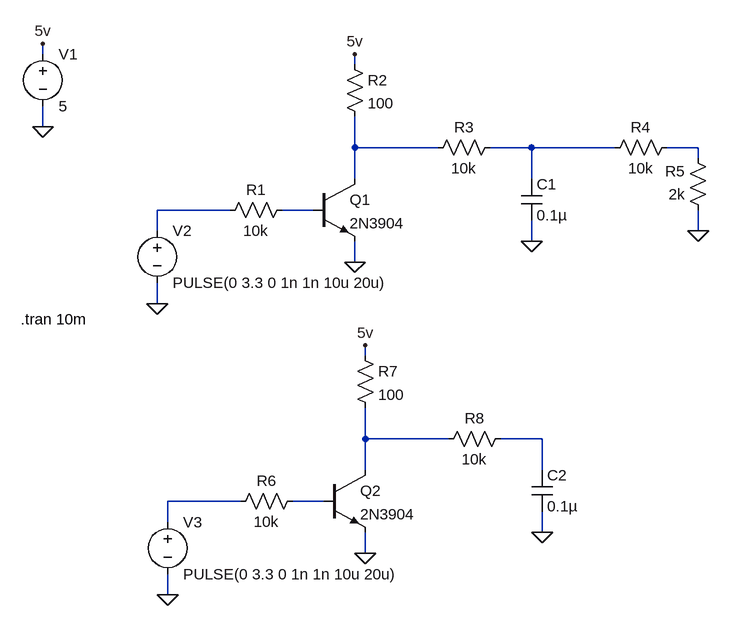
[diagram p0: schematic cmd_pwm_tran.asc]
cmd_pwm_tran.asc, the LTspice schematic file:
Version 4
SHEET 1 880 788
WIRE -304 -64 -304 -80
WIRE 176 -48 176 -64
WIRE -304 48 -304 16
WIRE 176 80 176 32
WIRE 304 80 176 80
WIRE 448 80 384 80
WIRE 576 80 448 80
WIRE 704 80 656 80
WIRE 704 96 704 80
WIRE 176 128 176 80
WIRE 448 128 448 80
WIRE -16 176 -128 176
WIRE 112 176 64 176
WIRE -128 208 -128 176
WIRE 704 208 704 176
WIRE 448 224 448 192
WIRE 176 256 176 224
WIRE -128 320 -128 288
WIRE 192 400 192 384
WIRE 192 528 192 480
WIRE 320 528 192 528
WIRE 464 528 400 528
WIRE 192 576 192 528
WIRE 464 576 464 528
WIRE 0 624 -112 624
WIRE 128 624 80 624
WIRE -112 656 -112 624
WIRE 464 672 464 640
WIRE 192 704 192 672
WIRE -112 768 -112 736
FLAG 176 256 0
FLAG 448 224 0
FLAG 176 -64 5v
FLAG -304 48 0
FLAG -304 -80 5v
FLAG -128 320 0
FLAG 704 208 0
FLAG 192 704 0
FLAG 464 672 0
FLAG 192 384 5v
FLAG -112 768 0
SYMBOL npn 112 128 R0
SYMATTR InstName Q1
SYMATTR Value 2N3904
SYMBOL res 80 160 R90
WINDOW 0 0 56 VBottom 2
WINDOW 3 32 56 VTop 2
SYMATTR InstName R1
SYMATTR Value 10k
SYMBOL res 160 -64 R0
SYMATTR InstName R2
SYMATTR Value 100
SYMBOL res 400 64 R90
WINDOW 0 0 56 VBottom 2
WINDOW 3 32 56 VTop 2
SYMATTR InstName R3
SYMATTR Value 10k
SYMBOL cap 432 128 R0
SYMATTR InstName C1
SYMATTR Value 0.1µ
SYMBOL voltage -304 -80 R0
SYMATTR InstName V1
SYMATTR Value 5
SYMBOL voltage -128 192 R0
WINDOW 123 0 0 Left 0
WINDOW 39 0 0 Left 0
SYMATTR InstName V2
SYMATTR Value PULSE(0 3.3 0 1n 1n 10u 20u)
SYMBOL res 672 64 R90
WINDOW 0 0 56 VBottom 2
WINDOW 3 32 56 VTop 2
SYMATTR InstName R4
SYMATTR Value 10k
SYMBOL res 720 192 R180
WINDOW 0 36 76 Left 2
WINDOW 3 36 40 Left 2
SYMATTR InstName R5
SYMATTR Value 2k
SYMBOL npn 128 576 R0
SYMATTR InstName Q2
SYMATTR Value 2N3904
SYMBOL res 96 608 R90
WINDOW 0 0 56 VBottom 2
WINDOW 3 32 56 VTop 2
SYMATTR InstName R6
SYMATTR Value 10k
SYMBOL res 176 384 R0
SYMATTR InstName R7
SYMATTR Value 100
SYMBOL res 416 512 R90
WINDOW 0 0 56 VBottom 2
WINDOW 3 32 56 VTop 2
SYMATTR InstName R8
SYMATTR Value 10k
SYMBOL cap 448 576 R0
SYMATTR InstName C2
SYMATTR Value 0.1µ
SYMBOL voltage -112 640 R0
WINDOW 123 0 0 Left 0
WINDOW 39 0 0 Left 0
SYMATTR InstName V3
SYMATTR Value PULSE(0 3.3 0 1n 1n 10u 20u)
TEXT -338 344 Left 2 !.tran 10m

The netlist it stands for:
* cmd_pwm_tran.asc
Q1 N001 N005 0 0 2N3904
R1 N005 N004 10k
R2 5v N001 100
R3 N002 N001 10k
C1 N002 0 0.1µ
V1 5v 0 5
V2 N004 0 PULSE(0 3.3 0 1n 1n 10u 20u)
R4 N003 N002 10k
R5 0 N003 2k
Q2 N006 N009 0 0 2N3904
R6 N009 N008 10k
R7 5v N006 100
R8 N007 N006 10k
C2 N007 0 0.1µ
V3 N008 0 PULSE(0 3.3 0 1n 1n 10u 20u)
.model NPN NPN
.model PNP PNP
.lib standard.bjt
.tran 10m
.backanno
.end